# EasyEDA Pro project ProPrj_M-power_2025-07-25.epro, board 电源
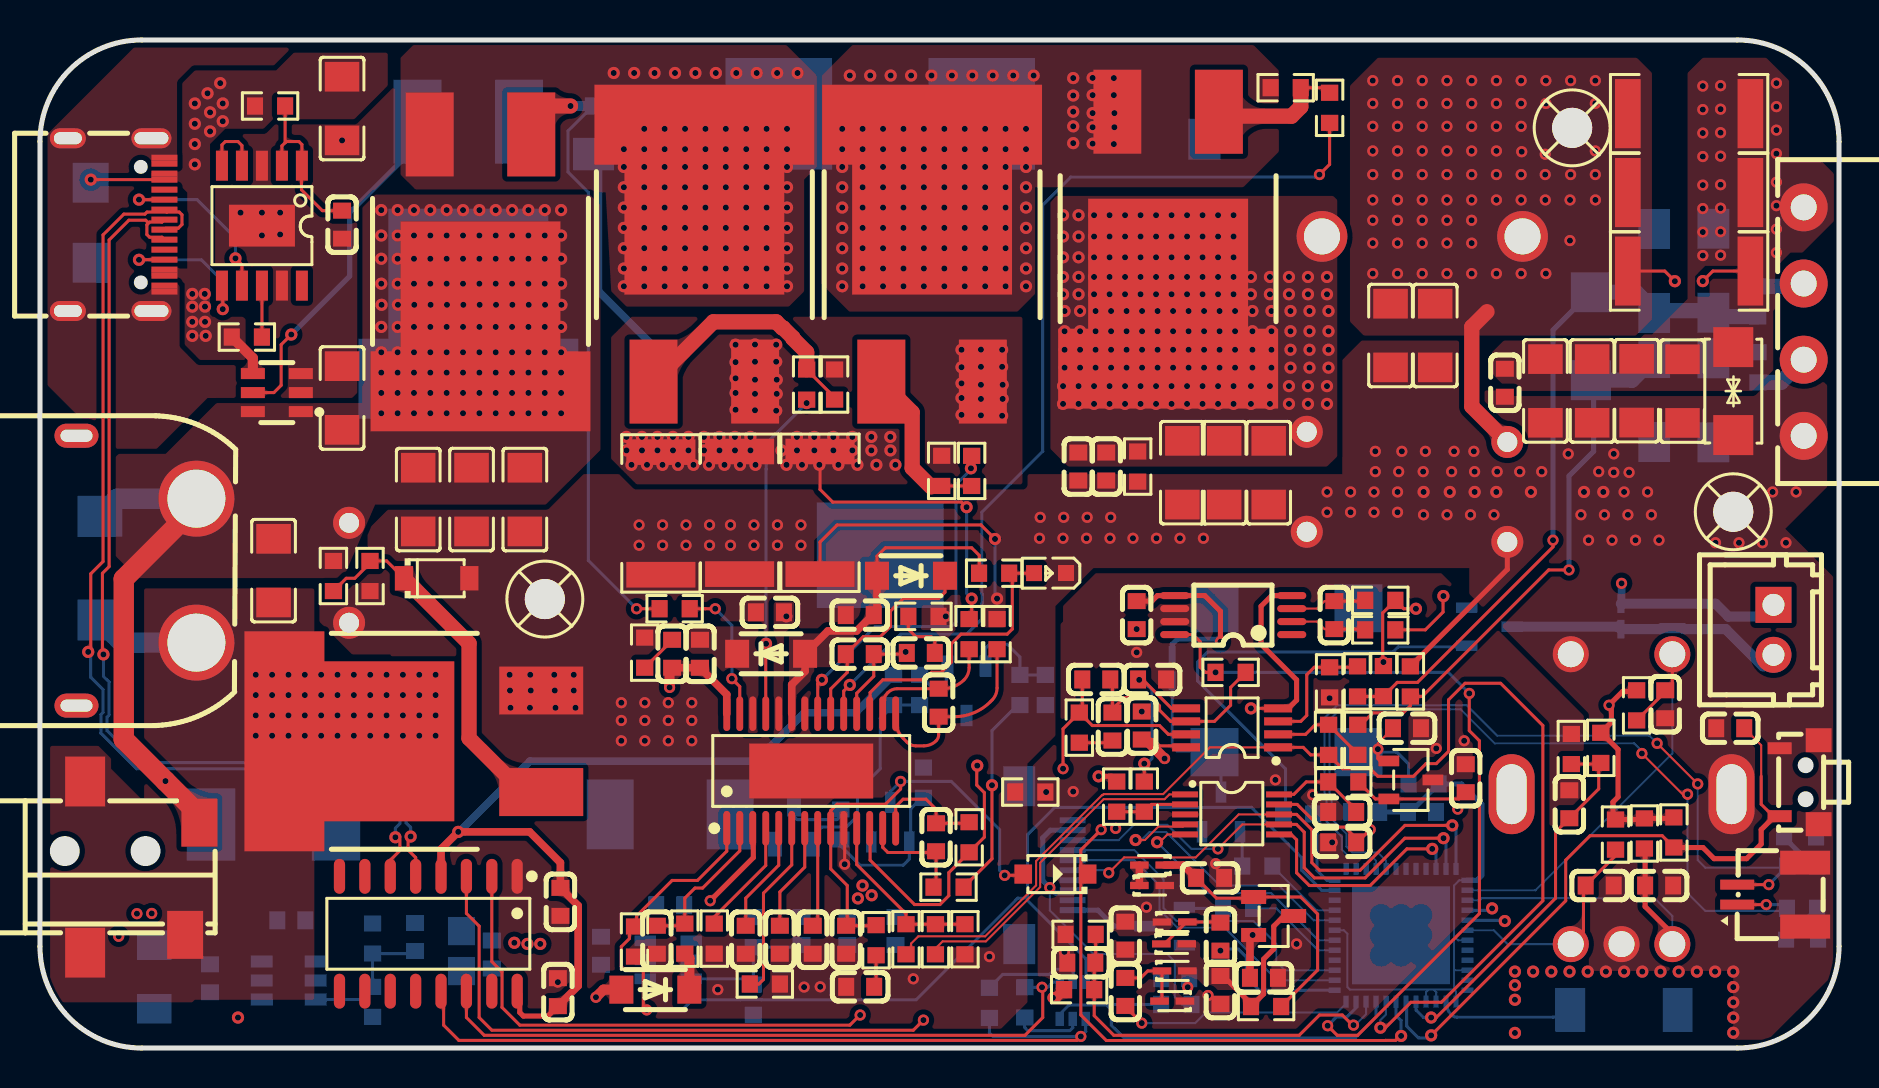
[diagram p2: board, top side]
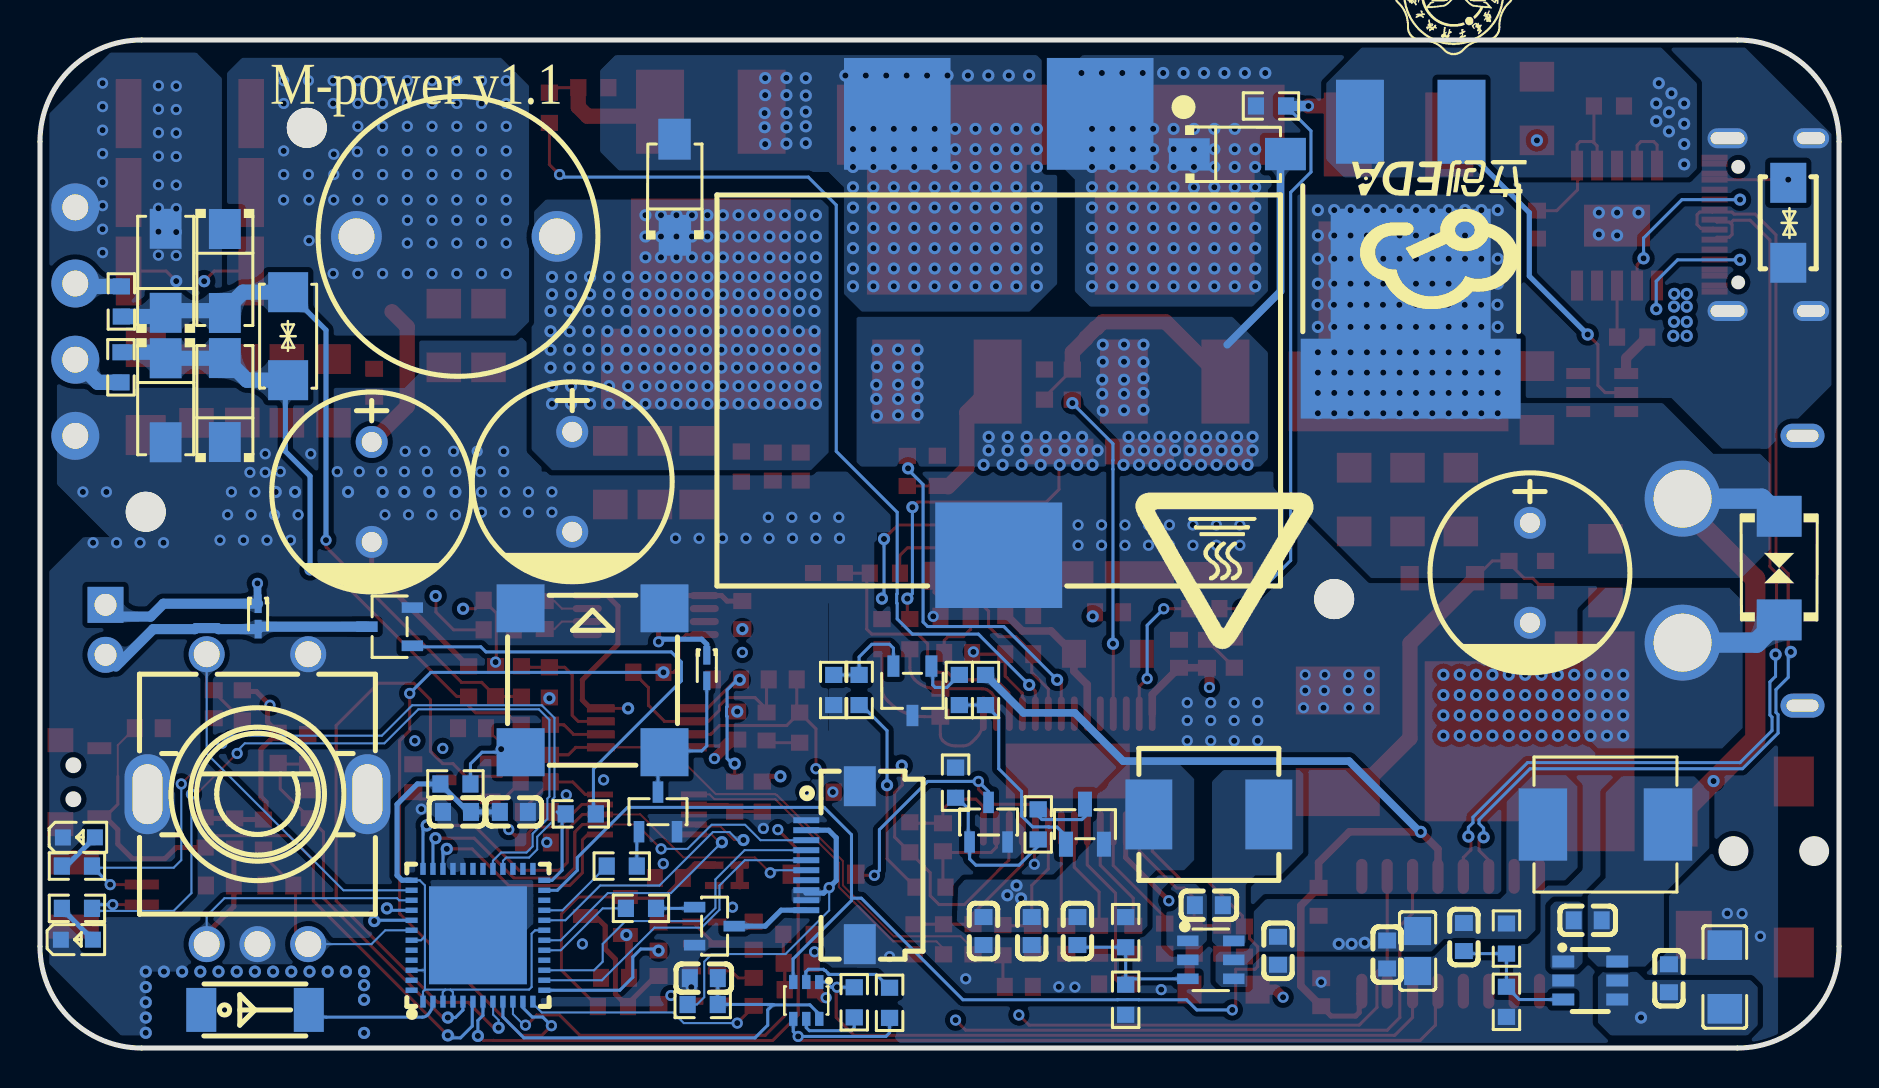
[diagram p3: board, bottom side, seen from below]

Outline 90 x 50.42 mm; copper layers: Top Layer, 内层1, 内层2, Bottom Layer. Coordinates in mm from the lower left corner of the outline.
Outline path: 0,45.34 0,5.08 arc(1.49,1.49) 5.08,0 84.92,0 arc(88.51,1.49) 90,5.08 90,45.34 arc(88.51,48.93) 84.92,50.42 5.08,50.42 arc(1.49,48.93) 0,45.34
Stack: Top Layer 0.035mm 外层铜厚1oz / Dielectric1 0.2104mm 7628 RC49% 8.6mil / 内层1 0.0152mm 内层铜厚 / Dielectric2 1.065mm 1.1mm H/HOZ Copper / 内层2 0.0152mm 内层铜厚 / Dielectric3 0.2104mm 7628 RC49% 8.6mil / Bottom Layer 0.035mm 外层铜厚1oz

## Design rules (mm)
net CS_P: LM5175
net CS_N: LM5175
net IS_P: Isense
net IS_N: Isense
net USB_P: usb
net USB_N: usb
template: 自定义配置
spacing copperThickness1oz (default): track to track 0.102, other pairs 0.152 to 0.3
spacing copperThickness2oz: track to track 0.203, other pairs 0.152 to 0.3
track width copperThickness1oz (default): min 0.102, default 0.254, max 2.54
track width copperThickness2oz: min 0.203, default 0.254, max 2.54
differential pair differentialPair (default): width min 0.102, default 0.254, max 2.54; gap min 0.152, default 0.152
via viaSize (default): diameter min 0.5, default 0.61, max 10; hole min 0.3, default 0.305, max 6.299

## Placement (name value [footprint] x y rotation side)
BUZZER1  2.7kHz  [BUZ-SMD_4P-L8.5-W8.5-P8.50-BR]  62.36 18.39 180 bottom
C1  1uF  [C1206]  21.59 27.43 90 top
C3  1uF  [C1206]  24.26 27.43 90 top
C6  22uF  [C1206]  15.11 46.99 90 top
C7  10uF  [C1206]  15.11 32.51 270 top
C8  1uF  [C0603]  15.11 41.18 90 top
C10  100nF  [C0603]  8.51 3.49 270 bottom
C11  10uF  [C1206]  5.72 3.55 270 bottom
C12  100nF  [C0603]  12.57 6.39 180 bottom
C13  150pF  [C0603]  18.77 5.55 90 bottom
C14  22uF  [C0805]  21.08 4.85 90 bottom
C15  100nF  [C0603]  22.61 4.68 90 bottom
C16  100nF  [C0603]  31.53 7.14 180 bottom
C17  22uF  [C0603]  40.39 5.85 90 bottom
C19  150pF  [C0603]  38.1 5.85 90 bottom
C20  22uF  [C0603]  28.07 4.86 90 bottom
C21  100nF  [C0603]  42.8 5.85 90 bottom
C22  22nF  [C0603]  35.31 5.42 90 top
C23  1.5nF  [C0603]  37.01 5.42 90 top
C24  100nF  [C0603]  38.66 5.42 90 top
C25  100nF  [C0603]  30.86 5.42 270 top
C26  10nF  [C0603]  44.83 10.54 90 top
C27  2.7nF  [C0603]  40.33 5.42 90 top
C28  22nF  [C0603]  41.03 3.06 0 top
C29  1nF  [C0603]  44.96 17.27 90 top
C30  100nF  [C0603]  33.02 19.72 90 top
C31  100nF  [C0603]  41.01 19.7 180 top
C32  1uF  [C0603]  41.01 21.65 180 top
C33  470pF  [C0603]  31.62 19.72 270 top
C34  470pF  [C0603]  44.06 19.76 180 top
C35  1uF  [C0603]  36.52 21.79 0 top
C36  1uF  [C1206]  18.92 27.43 90 top
C37  1uF  [C1206]  11.68 23.88 90 top
C38  470uF  [CAP-TH_BD10.0-P5.00-D0.6-FD-A]  63.37 28.32 270 bottom
C39  470uF  [CAP-TH_BD10.0-P5.00-D0.6-FD-A]  73.41 27.81 270 bottom
C40  100nF  [C0603]  53.34 29.08 90 top
C41  10uF  [C1206]  59.24 28.78 90 top
C42  10uF  [C1206]  61.47 28.78 90 top
C43  10uF  [C1206]  69.8 35.64 90 top
C44  1uF  [C1206]  67.56 35.64 90 top
C45  100nF  [C0603]  73.28 33.27 90 top
C47  10uF  [C1206]  82.17 32.86 90 top
C48  10uF  [C1206]  79.87 32.88 90 top
C49  100nF  [C0603]  51.94 29.08 90 top
C50  10uF  [C1206]  57.15 28.78 90 top
C52  10uF  [C1206]  75.31 32.86 90 top
C53  10uF  [C1206]  77.65 32.86 90 top
C54  10nF  [C0603]  64.75 21.65 270 top
C55  100nF  [C0603]  54.86 21.65 90 top
C56  10nF  [C0603]  55.63 18.43 180 top
C57  100nF  [C0603]  53.65 16.08 270 top
C58  1nF  [C0603]  52.84 18.43 180 top
C59  100nF  [C0603]  55.12 16.13 270 top
C60  10uF  [C0603]  61.23 3.51 0 top
C61  1uF  [C0603]  58.54 8.51 0 top
C62  100nF  [C0603]  66.29 11.81 0 bottom
C63  10uF  [C0603]  69.14 11.81 180 bottom
C64  100nF  [C0603]  56.79 3.5 180 bottom
C65  100nF  [C0603]  25.91 2.79 270 top
C66  100nF  [C0603]  26.04 7.31 90 top
C67  10nF  [C0603]  52.09 4.27 0 top
C68  1uF  [C0603]  68.39 16 180 top
C69  1uF  [C0603]  71.33 13.49 270 top
C70  100nF  [C0603]  59.05 5.57 90 top
C71  10uF  [C0603]  54.3 5.62 90 top
C72  100nF  [C0603]  54.3 2.81 90 top
C73  10uF  [C0603]  59.05 2.9 270 top
C74  10uF  [C0603]  65.14 11.81 0 top
C75  100nF  [C0603]  65.14 10.29 0 top
C76  100nF  [C0603]  81 8.13 0 top
C77  100nF  [C0603]  78.03 8.13 180 top
C78  100nF  [C0603]  81.3 17.19 90 top
C79  100nF  [C0603]  76.51 12.19 270 top
C80  100nF  [C0603]  84.56 16 0 top
C81  470uF  [CAP-TH_BD10.0-P5.00-D0.6-FD-A]  15.46 23.77 270 bottom
CN1  XT60PW-M  [CONN-TH_XT60PW-M]  4.83 23.88 0 top
CN2  KF2EDGR-3.81-4P  [CONN-TH_4P-P3.81_KF2EDGR-3.81-4P]  88.23 36.33 90 top
CN3  ZX-XH2.54-2PZZ  [CONN-TH_2P-P2.50_HX25003-2A]  86.72 20.92 270 top
D1  SMBJ30CA  [SMB_L4.6-W3.6-LS5.3-BI]  2.99 24 90 bottom
D2  BZT52C12  [SOD-123_L2.7-W1.6-LS3.7-RD]  19.84 23.5 0 top
D3  SMAJ22CA  [SMA_L4.4-W2.6-LS5.0-BI]  2.54 41.28 90 bottom
D5  SS56  [SMA_L4.3-W2.6-LS5.0-RD]  30.1 44.7 180 bottom
D7  SMAJ40CA  [SMA_L4.3-W2.6-LS5.0-BI]  84.71 32.86 90 top
D8  1N4148W  [SOD-123_L2.7-W1.6-LS3.7-FD]  50.8 8.7 0 top
D9  1N4007  [SMA_L4.3-W2.5-LS5.0-RD]  80.75 32.41 90 bottom
D10  1N4007  [SMA_L4.3-W2.5-LS5.0-RD]  83.71 32.4 270 bottom
D11  1N4007  [SMA_L4.3-W2.5-LS5.0-RD]  80.75 38.86 270 bottom
D12  1N4007  [SMA_L4.3-W2.5-LS5.0-RD]  83.71 38.87 90 bottom
D13  1N4148WT  [SOD-523_L1.2-W0.8-LS1.6-RD]  55.63 8.13 0 top
D14  1N4148WT  [SOD-523_L1.2-W0.8-LS1.6-RD]  55.63 9.15 180 top
D15  1N4148WT  [SOD-523_L1.2-W0.8-LS1.6-RD]  56.76 6.3 0 top
D16  1N4148WT  [SOD-523_L1.2-W0.8-LS1.6-RD]  56.73 5.21 0 top
D17  1N4148WT  [SOD-523_L1.2-W0.8-LS1.6-RD]  56.64 2.35 180 top
D18  1N4148WT  [SOD-523_L1.2-W0.8-LS1.6-RD]  56.76 3.86 0 top
D19  1N4148WT  [SOD-523_L1.2-W0.8-LS1.6-RD]  56.64 19.01 270 bottom
D20  1N4148WT  [SOD-523_L1.2-W0.8-LS1.6-RD]  79.09 21.59 270 bottom
D22  SMAJ40CA  [SMA_L4.3-W2.6-LS5.0-BI]  77.59 35.6 270 bottom
D23  DSK110  [SOD-123FL_L2.8-W1.9-LS3.7-RD]  36.58 19.72 0 top
D24  DSK110  [SOD-123FL_L2.8-W1.9-LS3.7-RD]  43.57 23.62 180 top
D25  DSK110  [SOD-123FL_L2.8-W1.9-LS3.7-RD]  30.79 2.92 180 top
D26  SS56  [SMA_L4.3-W2.6-LS5.0-RD]  58.25 43.05 90 bottom
FPC1  AFC01-S10FCA-00  [FPC-SMD_P0.5-10P_FGS-XJ-H2.0]  50.33 9.14 270 bottom
L1  10uH  [IND-SMD_L7.0-W6.6_FXL0630]  11.68 11.18 180 bottom
L2  10uH  [IND-SMD_L7.3-W6.8]  31.53 11.68 0 bottom
L3  10uH  [IND-SMD_3P-L28.0-W19.4_7443641000B]  42.04 35.69 0 bottom
L5  AN2051-245  [ANT2051]  79.24 1.91 180 bottom
L6  -  [2.2uh磁棒]  64.14 40.59 0 bottom
LED1  -  [LED_0603]  50.48 23.75 180 top
LED2  -  [LED_0603]  88 10.54 180 bottom
LED3  -  [LED_0603]  88.1 5.42 180 bottom
P1  DC031A 贴片  [DC-IN-SMD_DC031A]  5.12 9.05 0 top
Q3  S8550  [SOT-23-3_L2.9-W1.3-P1.90-LS2.4-BR]  37.72 11.2 270 bottom
Q4  S8050  [SOT-23-3_L2.9-W1.3-P1.90-LS2.3-BR]  42.55 11.3 270 bottom
Q5  SS8550  [SOT-23-3_L2.9-W1.3-P1.90-LS2.4-BR]  61.72 6.6 180 top
Q6  BC847BDW1T1G  [SOT-363_L2.0-W1.3-P0.65-LS2.1-TL]  51.67 2.38 270 bottom
Q7  S8050  [SOT-23-3_L2.9-W1.3-P1.90-LS2.3-BR]  59.08 11.81 270 bottom
Q8  SI2306  [SOT-23-3_L2.9-W1.4-P1.91-LS2.6-BR]  72.51 21.07 180 bottom
Q9  S8050  [SOT-23-3_L2.9-W1.3-P1.90-LS2.3-BR]  56.26 6.1 0 bottom
R1  100K  [R0603]  14.68 23.61 90 top
R2  150K  [R0603]  16.51 23.61 90 top
R3  10K  [R0603]  10.35 35.56 0 top
R4  1K  [R0603]  11.51 47.12 180 top
R5  10K  [R0603]  16.64 2.31 90 bottom
R6  140K  [R0603]  16.64 5.47 90 bottom
R7  100K  [R0603]  35.69 5.79 90 bottom
R8  22K  [R0603]  35.69 2.41 90 bottom
R9  10  [R0603]  32.26 5.47 90 top
R10  47k  [R0603]  36.26 3.2 180 top
R11  49.9K  [R0603]  33.73 5.47 90 top
R12  10K 0.1%  [R0603]  43.32 5.44 270 top
R13  10K 0.1%  [R0603]  44.8 5.44 90 top
R14  4.99K 0.1%  [R0603]  46.27 5.44 90 top
R15  3.3  [R0603]  45.45 8.05 180 top
R16  3.3  [R0603]  46.48 10.54 90 top
R17  6.8K  [R0603]  41.83 5.39 90 top
R18  10  [R0603]  46.48 20.7 90 top
R19  10  [R0603]  47.88 20.7 90 top
R20  20K  [R0603]  28.42 47.12 180 bottom
R21  20K  [R0603]  39.75 33.19 270 top
R22  20K  [R0603]  62.32 48.03 0 top
R23  20K  [R0603]  45.11 28.87 270 top
R24  5mΩ  [R2512]  35 26.77 90 top
R25  5mΩ  [R2512]  31.06 26.74 90 top
R26  5mΩ  [R2512]  39.02 26.77 90 top
R27  1  [R0603]  31.75 21.97 180 top
R28  1  [R0603]  38.35 33.18 90 top
R29  1  [R0603]  64.52 47.03 270 top
R30  1  [R0603]  46.61 28.86 90 top
R31  10K  [R0603]  29.74 5.33 270 top
R32  10K  [R0603]  47.73 23.75 180 top
R33  10  [R0603]  30.25 19.78 270 top
R34  10  [R0603]  44.2 21.59 180 top
R35  NC  [R0603]  54.91 29.08 90 top
R36  5mΩ  [R2512]  82.5 38.86 0 top
R37  5mΩ  [R2512]  82.5 42.79 0 top
R38  5mΩ  [R2512]  82.5 46.74 0 top
R39  1  [R0603]  67.05 20.92 180 top
R40  1  [R0603]  67.05 22.39 180 top
R41  10K  [R0603]  59.56 18.79 0 top
R42  10K  [R0603]  55.24 12.57 90 top
R43  20K  [R0603]  53.86 12.57 270 top
R44  2.2K  [R0603]  51.99 16.02 90 top
R45  1M 0.1%  [R0603]  65.92 15.42 270 top
R46  1M 0.1%  [R0603]  65.91 18.34 90 top
R47  68K 0.1%  [R0603]  64.46 15.42 270 top
R48  68K 0.1%  [R0603]  64.52 18.29 270 top
R49  10K  [R0603]  68.56 18.34 270 top
R50  10K  [R0603]  67.21 18.35 90 top
R51  2.2  [R0603]  85.95 34.05 90 bottom
R52  2.2  [R0603]  85.93 37.34 270 bottom
R53  1M  [R0603]  49.02 17.91 270 bottom
R54  51K  [R0603]  50.29 17.91 90 bottom
R55  200  [R0603]  44.01 17.91 270 bottom
R56  1K  [R0603]  42.7 17.91 270 bottom
R57  4.7K  [R0603]  40.06 11.18 90 bottom
R58  10K  [R0603]  44.2 13.27 270 bottom
R59  10K  [R0603]  61.34 2.07 0 top
R60  0  [R0603]  69.22 13.21 180 bottom
R61  10K  [R0603]  56.85 2.18 0 bottom
R62  1K  [R0603]  47.5 2.26 270 bottom
R63  1K  [R0603]  49.27 2.29 270 bottom
R64  1M 0.1%  [R0603]  51.99 2.92 180 top
R65  68K 0.1%  [R0603]  52.06 5.68 180 top
R66  0  [R0603]  65.2 13.31 0 top
R67  10K  [R0603]  79.87 17.14 90 top
R68  10K  [R0603]  80.26 10.73 270 top
R69  10K  [R0603]  78.82 10.67 90 top
R70  470  [R0603]  60.9 9.1 180 bottom
R71  1K  [R0603]  62.95 11.71 180 bottom
R72  NCP18XH103F03RB  [R0603]  76.61 14.95 270 top
R73  1K  [R0603]  78.08 15.01 90 top
R74  470  [R0603]  59.93 6.98 180 bottom
R75  10K  [R0603]  81.74 10.78 90 top
R76  510  [R0603]  88.15 9.1 180 bottom
R77  510  [R0603]  88.15 6.98 180 bottom
R78  0  [R0603]  49.54 12.8 180 top
SCREW2  -  [M2螺丝]  25.26 22.45 0 top
SCREW3  -  [M2螺丝]  84.71 26.82 0 top
SCREW4  -  [M2螺丝]  76.65 46.02 0 top
SW1  EC11E18244AU  [SW-TH_EC11XXXXXXXX]  79.12 12.45 180 bottom
SW2  TS-1010-C-A  [KEY-SMD_TX-1010-X-X]  88.01 13.3 270 top
U1  CSD18536KTT  [TO-263-3_L10.4-W10.1-P5.08-LS15.4-BRM]  44.63 38.13 0 top
U2  LM5050MKX-1/NOPB  [TSOT-23-6_L2.9-W1.6-P0.95-LS2.8-BL]  11.85 32.78 90 top
U3  CH224K  [ESSOP-10_L4.9-W3.9-P1.0-LS6.0-TL-EP]  11.1 41.13 180 top
U4  ME3121AM6G  [SOT-23-6_L2.9-W1.6-P0.95-LS2.8-BR]  12.45 3.38 0 bottom
U5  SY8120IABC  [SOT-23-6_L2.9-W1.6-P0.95-LS2.8-BL]  31.43 4.41 270 bottom
U6  LM5175PWPR  [HTSSOP-28_L9.8-W4.5-P0.65-LS6.6-BL-EP]  38.58 13.86 0 top
U7  CSD18536KTT  [TO-263-3_L10.4-W10.1-P5.08-LS15.4-BRM]  22.04 40.89 180 top
U8  CSD18536KTT  [TO-263-3_L10.4-W10.1-P5.08-LS15.4-BRM]  33.24 38.13 0 top
U9  CSD18536KTT  [TO-263-3_L10.4-W10.1-P5.08-LS15.4-BRM]  56.44 42.03 180 top
U10  INA240A2PWR  [TSSOP-8_L4.4-W3.0-P0.65-LS6.4-BL]  59.69 21.65 90 top
U11  RS8552XM  [MSOP-8_L3.0-W3.0-P0.65-LS4.9-BL]  59.64 16.01 90 top
U12  TL431AIDBZR  [SOT-23-3_L2.9-W1.6-P1.90-LS2.8-BR]  46.36 17.87 90 bottom
U13  ESP32-PICO-D4  [LGA-48_L7.0-W7.0-P0.50-BL-EP5.4]  68.09 5.64 180 bottom
U14  CH340C  [SOP-16_L10.0-W3.9-P1.27-LS6.0-BL]  19.43 5.72 180 top
U15  REF3033AIDBZR  [SOT-23-3_L3.0-W1.7-P0.95-LS2.9-BR]  68.58 13.41 180 top
U16  DAC8562SDGSR  [VSSOP-10_L3.0-W3.0-P0.50-LS4.9-BL]  59.64 11.68 270 top
U18  CSD18536KTT  [TO-263-3_L10.4-W10.1-P5.08-LS15.4-BRM]  21.43 41.53 0 bottom
U19  CSD18536KTT  [TO-263-3_L10.4-W10.1-P5.08-LS15.4-BRM]  20.28 15.34 90 top
U20  WAFER-SH1.0-2PWB  [CONN-SMD_2P-P1.00_XUNPU_WAFER-SH1.0-2PWB]  86.61 7.67 90 top
USB1  KH-TYPE-C-16P  [USB-C-SMD_KH-TYPE-C-16P]  3.81 41.18 270 top

## Footprints (pads in the part's own frame, mm; a bottom-side part is the same pattern mirrored in y, then rotated)
2.2uh磁棒
  round 2.54 hole 1.8: 1(0,0) 2(10.033,0)
ANT2051
  rect 1.5x2.2 smd: 1(-2.69,0) 2(2.69,0)
BUZ-SMD_4P-L8.5-W8.5-P8.50-BR
  rect 2.4x2.4 smd: 1(-3.6,-3.6) 2(3.6,-3.6) 3(3.599,3.599) 4(-3.6,3.6)
C0603
  rect 0.8x0.9 smd: 1(-0.7,0) 2(0.7,0)
C0805
  rect 1.41x1.35 smd: 1(-1,0) 2(1,0)
C1206
  rect 1.485x1.728 smd: 1(-1.593,0) 2(1.593,0)
CAP-TH_BD10.0-P5.00-D0.6-FD-A
  round 1.6 hole 1: 1(-2.5,0) 2(2.5,0)
CONN-SMD_2P-P1.00_XUNPU_WAFER-SH1.0-2PWB
  rect 0.5x1.7 smd: 1(-0.5,1.7) 2(0.5,1.7)
  rect 1.2x2.5 smd: 3(1.6,-1.7) 4(-1.6,-1.7)
CONN-TH_2P-P2.50_HX25003-2A
  rect 1.8x1.8 hole 1.1: 1(-1.25,0)
  round 1.8 hole 1.1: 2(1.25,0)
CONN-TH_4P-P3.81_KF2EDGR-3.81-4P
  round 2.4 hole 1.3: 1(-5.715,0) 2(-1.905,0) 3(1.905,0) 4(5.715,0)
CONN-TH_XT60PW-M
  round 3.8 hole 2.9: 1(3,-3.6) 2(3,3.6)
  oval 2.2x1.2 hole 1.6x0.6: 3(-3,6.75) 4(-3,-6.75)
DC-IN-SMD_DC031A
  rect 1.8x2.401 smd: 2(2.857,2.223) 3(2.146,-3.391)
  rect 2x2.5 smd: 4(-2.857,4.28) 4(-2.857,-4.28)
ESSOP-10_L4.9-W3.9-P1.0-LS6.0-TL-EP
  rect 0.6x1.5 smd: 1(-2,-3) 2(-1,-3) 3(0,-3) 4(1,-3) 5(2,-3) 6(2,3) 7(1,3) 8(0,3) 9(-1,3) 10(-2,3)
  rect 3.3x2.1 smd: 11(0,0)
FPC-SMD_P0.5-10P_FGS-XJ-H2.0
  rect 0.3x1.3 smd: 1(-2.25,-1.339) 2(-1.75,-1.339) 3(-1.25,-1.34) 4(-0.75,-1.339) 5(-0.25,-1.34) 6(0.25,-1.339) 7(0.75,-1.339) 8(1.25,-1.339) 9(1.75,-1.339) 10(2.25,-1.34)
  rect 2x1.6 smd: 11(3.95,1.34) 12(-3.95,1.34)
HTSSOP-28_L9.8-W4.5-P0.65-LS6.6-BL-EP
  oval 0.343x1.732 smd: 1(-4.225,-2.866) 2(-3.575,-2.866) 3(-2.925,-2.866) 4(-2.275,-2.866) 5(-1.625,-2.866) 6(-0.975,-2.866) 7(-0.325,-2.866) 8(0.325,-2.866) 9(0.975,-2.866) 10(1.625,-2.866) 11(2.275,-2.866) 12(2.925,-2.866) 13(3.575,-2.866) 14(4.225,-2.866) 15(4.225,2.866) 16(3.575,2.866) 17(2.925,2.866) 18(2.275,2.866) 19(1.625,2.866) 20(0.975,2.866) 21(0.325,2.866) 22(-0.325,2.866) 23(-0.975,2.866) 24(-1.625,2.866) 25(-2.275,2.866) 26(-2.925,2.866) 27(-3.575,2.866) 28(-4.225,2.866)
  rect 6.2x2.75 smd: 29(0,0)
IND-SMD_3P-L28.0-W19.4_7443641000B
  rect 5.33x5.59 smd: 1(-5.075,-11.037) 2(5.075,-11.037)
  rect 6.35x5.28 smd: 3(0,11.037)
IND-SMD_L7.0-W6.6_FXL0630
  rect 2.424x3.62 smd: 1(3.128,0) 2(-3.128,0)
IND-SMD_L7.3-W6.8
  rect 2.35x3.5 smd: 1(-3,0) 2(3,0)
KEY-SMD_TX-1010-X-X
  rect 0.6x1.2 smd: 1(-1.7,-0.975) 2(1.7,-0.975)
  rect 1.2x1.3 smd: 3(-2.1,0.975) 4(2.1,0.975)
LED_0603
  rect 0.8x0.8 smd: 1(-0.851,-0.01) 2(0.75,-0.005)
LGA-48_L7.0-W7.0-P0.50-BL-EP5.4
  rect 0.27x0.6 smd: 1(-2.75,-3.32) 2(-2.25,-3.32) 3(-1.75,-3.32) 4(-1.25,-3.32) 5(-0.75,-3.32) 6(-0.25,-3.32) 7(0.25,-3.32) 8(0.75,-3.32) 9(1.25,-3.32) 10(1.75,-3.32) 11(2.25,-3.32) 12(2.75,-3.32) 25(2.75,3.32) 26(2.25,3.32) 27(1.75,3.32) 28(1.25,3.32) 29(0.75,3.32) 30(0.25,3.32) 31(-0.25,3.32) 32(-0.75,3.32) 33(-1.25,3.32) 34(-1.75,3.32) 35(-2.25,3.32) 36(-2.75,3.32)
  rect 0.6x0.27 smd: 13(3.32,-2.75) 14(3.32,-2.25) 15(3.32,-1.75) 16(3.32,-1.25) 17(3.32,-0.75) 18(3.32,-0.25) 19(3.32,0.25) 20(3.32,0.75) 21(3.32,1.25) 22(3.32,1.75) 23(3.32,2.25) 24(3.32,2.75) 37(-3.32,2.75) 38(-3.32,2.25) 39(-3.32,1.75) 40(-3.32,1.25) 41(-3.32,0.75) 42(-3.32,0.25) 43(-3.32,-0.25) 44(-3.32,-0.75) 45(-3.32,-1.25) 46(-3.32,-1.75) 47(-3.32,-2.25) 48(-3.32,-2.75)
  rect 4.9x4.9 smd: 49(0,0)
M2螺丝
  round 2 hole 2: 1(0,0)
MSOP-8_L3.0-W3.0-P0.65-LS4.9-BL
  rect 0.406x1.397 smd: 1(-0.975,-2.3) 2(-0.325,-2.3) 3(0.325,-2.3) 4(0.975,-2.3) 5(0.975,2.3) 6(0.325,2.3) 7(-0.325,2.3) 8(-0.975,2.3)
R0603
  rect 0.806x0.864 smd: 1(-0.753,0) 2(0.753,0)
R2512
  rect 1.282x3.456 smd: 1(-3.067,0) 2(3.067,0)
SMA_L4.3-W2.5-LS5.0-RD
  rect 2x1.593 smd: 1(-2.1,0) 2(2.1,0)
SMA_L4.3-W2.6-LS5.0-BI
  rect 2x2 smd: 1(-2.2,0) 2(2.2,0)
SMA_L4.3-W2.6-LS5.0-RD
  rect 2.046x1.62 smd: 1(-2.404,-0.009) 2(2.404,0.009)
SMA_L4.4-W2.6-LS5.0-BI
  rect 2x1.8 smd: 1(-2,0) 2(2,0)
SMB_L4.6-W3.6-LS5.3-BI
  rect 2.047x2.241 smd: 1(-2.591,0) 2(2.591,0)
SOD-123_L2.7-W1.6-LS3.7-FD
  rect 0.88x0.96 smd: 1(-1.61,0) 2(1.61,0)
SOD-123_L2.7-W1.6-LS3.7-RD
  rect 0.91x1.22 smd: 1(-1.635,0) 2(1.635,0)
SOD-123FL_L2.8-W1.9-LS3.7-RD
  rect 1.2x1.4 smd: 1(-1.7,0) 2(1.7,0)
SOD-523_L1.2-W0.8-LS1.6-RD
  rect 0.93x0.36 smd: 1(-0.635,0) 2(0.635,0)
SOP-16_L10.0-W3.9-P1.27-LS6.0-BL
  oval 0.56x1.745 smd: 1(-4.445,-2.873) 2(-3.175,-2.873) 3(-1.905,-2.873) 4(-0.635,-2.873) 5(0.635,-2.873) 6(1.905,-2.873) 7(3.175,-2.873) 8(4.445,-2.873) 9(4.445,2.873) 10(3.175,2.873) 11(1.905,2.873) 12(0.635,2.873) 13(-0.635,2.873) 14(-1.905,2.873) 15(-3.175,2.873) 16(-4.445,2.873)
SOT-23-3_L2.9-W1.3-P1.90-LS2.3-BR
  rect 1.07x0.532 smd: 1(0.99,-0.95) 2(0.99,0.95) 3(-0.99,0)
SOT-23-3_L2.9-W1.3-P1.90-LS2.4-BR
  rect 1.25x0.7 smd: 1(1,-0.95) 2(1,0.95) 3(-1,0)
SOT-23-3_L2.9-W1.4-P1.91-LS2.6-BR
  rect 1.07x0.532 smd: 1(1.135,-0.955) 2(1.135,0.955) 3(-1.135,0)
SOT-23-3_L2.9-W1.6-P1.90-LS2.8-BR
  rect 1.07x0.6 smd: 1(1.235,-0.95) 2(1.235,0.95) 3(-1.235,0)
SOT-23-3_L3.0-W1.7-P0.95-LS2.9-BR
  rect 1.038x0.532 smd: 1(1.101,-0.95) 2(1.101,0.95) 3(-1.101,0)
SOT-23-6_L2.9-W1.6-P0.95-LS2.8-BL
  rect 0.532x1.072 smd: 1(-0.95,-1.149) 2(0,-1.149) 3(0.95,-1.149) 4(0.95,1.149) 5(0,1.149) 6(-0.95,1.149)
SOT-23-6_L2.9-W1.6-P0.95-LS2.8-BR
  rect 1.1x0.6 smd: 1(1.35,-0.95) 2(1.35,0) 3(1.35,0.95) 4(-1.35,0.95) 5(-1.35,0) 6(-1.35,-0.95)
SOT-363_L2.0-W1.3-P0.65-LS2.1-TL
  rect 0.7x0.42 smd: 1(-0.92,0.65) 2(-0.92,0) 3(-0.92,-0.65) 4(0.92,-0.65) 5(0.92,0) 6(0.92,0.65)
SW-TH_EC11XXXXXXXX
  oval 2.3x4 hole 1.5x3: 6(5.5,0.25) 7(-5.5,0.25)
  round 1.8 hole 1.3: A(-2.54,-7.25) B(2.54,-7.25) C(0,-7.25) D(-2.54,7.25) E(2.54,7.25)
TO-263-3_L10.4-W10.1-P5.08-LS15.4-BRM
  rect 2.4x4.2 smd: 1(-2.54,-4.8) 3(2.54,-4.8)
  custom 11x10.5 smd: 2(0,4.8)
TSOT-23-6_L2.9-W1.6-P0.95-LS2.8-BL
  rect 0.55x1.2 smd: 1(-0.95,-1.2) 2(0,-1.2) 3(0.95,-1.2) 4(0.95,1.2) 5(0,1.2) 6(-0.95,1.2)
TSSOP-8_L4.4-W3.0-P0.65-LS6.4-BL
  oval 0.353x1.454 smd: 1(-0.975,-2.927) 2(-0.325,-2.927) 3(0.325,-2.927) 4(0.975,-2.927) 5(0.975,2.927) 6(0.325,2.927) 7(-0.325,2.927) 8(-0.975,2.927)
USB-C-SMD_KH-TYPE-C-16P
  oval 1x2 hole 0.6x1.7: 1(-4.32,1.765) 2(4.32,1.765)
  oval 1x1.8 hole 0.6x1.4: 3(-4.32,-2.415) 4(4.32,-2.415)
  rect 0.3x1.3 smd: A1(-3.35,2.415) A4(-2.55,2.415) A5(-1.25,2.415) A6(-0.25,2.415) A7(0.25,2.415) A8(1.25,2.415) A9(2.55,2.415) A12(3.35,2.415) B1(3.05,2.415) B4(2.25,2.415) B5(1.75,2.415) B6(0.75,2.415) B7(-0.75,2.415) B8(-1.75,2.415) B9(-2.25,2.415) B12(-3.05,2.415)
VSSOP-10_L3.0-W3.0-P0.50-LS4.9-BL
  rect 0.3x1.3 smd: 1(-1,-2.35) 2(-0.5,-2.35) 3(0,-2.35) 4(0.5,-2.35) 5(1,-2.35) 6(1,2.35) 7(0.5,2.35) 8(0,2.35) 9(-0.5,2.35) 10(-1,2.35)

## Nets
As in the schematic.

Pads without a net: CN1 3 4; FPC1 7; L5 1; U3 10; U10 1; U13 25 26 27 30 31 32 33 44 45 47 48; U14 7 8 9 10 11 12 15; USB1 A8 B8

## Via types
v1: diameter 0.559, hole 0.305, Top Layer to Bottom Layer, 264 vias
v2: diameter 0.61, hole 0.305, Top Layer to Bottom Layer, 729 vias

## Routing (per net, layer and track width the routed paths; a pad name or vN(x,y) marks a point on that pad's centre or on a via; arc(x,y) is an arc through that point)
3.3V: length 171.9
  Top Layer w0.102: 67.69,16 66.93,15.24 v1(66.93,14.95)
  Top Layer w0.152: U11.8 57.26,15.11 56.01,15.11 55.69,15.43 55.31,15.43 ; U16.9 62.89,12.18 64.03,11.05 65.28,11.05 65.84,10.48 65.84,10.29 65.91,10.29 v1(66.55,10.93) 66.55,10.86 ; U15.1 67.05,14.36 66.93,14.48 v1(66.93,14.95)
  Top Layer w0.254: U14.16 24,2.71 24,1.78 24.18,1.6 25.41,1.6 C65.2 ; C55.2 55.63,22.35 55.9,22.63 U10.5 58.27,22.63 59.05,21.84 v1(59.05,20.32) ; R67.2 79.82,17.83 79.17,17.83 78.61,17.27 78.61,16.3 R73.2 78.11,15.77 78.95,14.93 78.95,12.56 78.69,12.3 78.69,11.56 R69.2 80.21,11.43 R68.1 81.69,11.48 R75.2
  Top Layer w0.381: U14.4 20.06,9.95 v2(20.92,10.81) 24.5,10.81 26.04,9.27 C66.2 26.92,7.12 26.92,3.11 C65.2
  Top Layer w0.508: C59.2 55.31,15.43 v1(56.26,14.48)
  内层1 w0.508: 67.31,15.71 62.7,20.32 v1(59.05,20.32) ; 67.31,15.71 67.99,16.38 72.01,16.38 72.77,17.14 78.74,17.14 79.5,17.91 ; 67.31,15.71 67.31,15.11 ; v2(41.61,7.64) 41.92,7.95 53.48,7.95 57.87,3.56 64.52,3.56 65.91,4.95 65.91,10.29 67.31,11.68 67.31,15.11 ; 67.31,15.11 66.29,14.1 56.64,14.1 v1(56.26,14.48)
  内层1 w0.762: v2(40.92,7.48) 41.15,7.71 v2(41.15,8.13) 41.61,7.67 v2(41.61,7.64)
  Bottom Layer w0.102: R61.2 57.13,2.18 56.77,2.54 56.77,4.32 56.39,4.7 52.7,4.7 50.52,6.89 v1(50.52,8.02)
  Bottom Layer w0.152: BUZZER1.1 67.88,14.79 68.46,14.21 R60.2
  Bottom Layer w0.254: v1(59.05,20.32) 58.93,20.45 56.9,20.45 56.64,20.19 D19.1 ; 51.69,7.75 50.8,7.75 50.52,8.02 v1(50.52,8.02) 50.17,8.38 50.17,10.51 50.55,10.89 FPC1.2
  Bottom Layer w0.381: R56.1 40.8,16.76 38.23,16.76 35.81,14.35 24.51,14.35 20.97,10.81 v2(20.92,10.81)
  vias: v1(78.49,17.14)
9V: length 77.4
  内层1 w0.381: 70.48,24.13 72.64,24.13 73.53,23.24 v1(79.12,23.24)
  内层1 w0.762: 70.48,24.13 53.34,24.13 47.69,18.48 42.99,18.48 39.37,22.1 37.85,22.1 v2(37.34,21.59) 37.16,21.41 37.16,19.87 34.42,17.13 34.42,14.6 v2(25.03,5.21) 24.97,5.26 v2(23.73,5.26)
  Bottom Layer w0.381: D20.1 79.12,22.25 v1(79.12,23.24)
  Bottom Layer w0.508: D20.1 83.82,22.22 84.47,21.58 86.21,21.58
  vias: v2(24.38,5.21)
-0.6V: length 39.4
  Top Layer w0.152: U11.4 v2(60.58,16.99)
  Top Layer w0.254: R43.1 53.6,13.59 v2(52.96,13.59) ; U10.4 61.62,22.63 61.09,22.1 61.09,20.19 62.86,18.42 62.86,17.4 62.48,17.02 61.97,17.02 U11.4
  Top Layer w0.381: C60.1 60.53,5.52 v2(60.67,5.65)
  内层1 w0.254: v2(54.86,20.95) 55.75,20.06 55.75,17.65 55.24,17.14 55.24,16.96 55.28,16.99 v2(60.58,16.99) ; 52.96,13.46 53.09,13.34 54.48,13.34 57.15,10.67 57.15,9.02 60.51,5.65 v2(60.67,5.65) ; 52.96,13.46 v2(52.96,13.59) ; 52.96,13.46 52.83,13.59 52.83,14.99 54.67,16.83 v2(55.12,16.83)
-2V: length 7.9
  Top Layer w0.254: 59.06,3.6 59.2,3.6 60.58,2.21 R59.1 61.21,2.7 61.21,4.45 61.72,4.95 61.72,6.1 62.23,6.6 Q5.3
AGND:
  vias: v1(50.34,12.8) v1(51.25,4.81) v1(51.69,12.83) v1(54.86,19.79) v1(55.35,7.04) v1(58.43,2.63) v1(58.82,9.22) v1(61.8,13.41) v1(62.86,5.21) v1(63.67,12.66) v1(64.64,10.29) v1(69.85,14.99) v1(71.25,15.37) v2(64.52,17.49)
GND: length 24.1
  Top Layer w0.152: R26.1 39.02,25.31 39.88,26.16 47.07,26.16 v2(47.78,25.46) ; v1(40.26,9.19) 40.26,10.94 U6.10
  Top Layer w0.254: R49.1 73.41,23.94 C39.2
  Bottom Layer w0.152: v2(47.78,25.46) 47.78,22.58 v2(47.88,22.48)
  vias: v1(3.94,5.59) v1(4.85,6.72) v1(5.59,6.73) v1(23.49,18.67) v1(23.51,17.88) v1(23.54,17.02) v1(24.53,18.67) v1(24.51,17.02) v1(24.55,17.88) v1(25.73,18.67) v1(25.75,17.88) v1(25.79,17.02) v1(25.91,3.29) v1(26.7,18.67) v1(26.7,17.88) v1(26.79,17.02) v1(29.08,17.27) v1(29.08,16.38) v1(29.08,15.37) v1(29.97,26.16) v1(29.97,25.15) v1(30.26,17.27) v1(30.26,16.38) v1(30.26,15.37) v1(31.15,26.16) v1(31.15,25.15) v1(31.43,17.27) v1(31.43,16.38) v1(31.43,15.37) v1(32.32,26.16) v1(32.32,25.15) v1(32.61,17.27) v1(32.61,16.38) v1(32.61,15.37) v1(33.5,26.16) v1(33.5,25.15) v1(33.91,2.92) v1(34.54,26.16) v1(34.54,25.15) v1(35.72,26.16) v1(35.72,25.15) v1(36.89,26.16) v1(36.89,25.15) v1(38.07,26.16) v1(38.07,25.15) v1(38.23,3.05) v1(39.03,3.06) v1(43.69,3.46) v1(45.31,21.59) v1(47.5,4.57) v1(50,25.5) v1(50.04,26.54) v1(51.21,26.54) v1(51.18,25.5) v1(52.39,26.54) v1(52.35,25.5) v1(53.53,25.5) v1(53.56,26.54) v1(53.81,10.98) v1(54.68,25.5) v1(55.85,25.5) v1(57.03,25.5) v1(57.42,3.04) v1(58.2,25.5) v1(64.39,27.81) v1(64.39,26.8) v1(65.56,27.81) v1(65.56,26.8) v1(66.8,29.84) v1(66.8,28.83) v1(66.74,27.81) v1(66.74,26.8) v1(67.91,27.81) v1(67.91,26.8) v1(67.97,28.83) v1(68.13,29.84) v1(69.2,28.83) v1(69.21,26.67) v1(69.31,29.84) v1(70.39,26.67) v1(70.62,28.83) v1(70.74,29.84) v1(70.92,11.95) v1(71.56,26.67) v1(71.73,29.84) v1(71.77,28.83) v1(72.74,26.67) v1(72.9,28.83) v1(74.03,28.83) v1(75.13,28.83) v1(76.45,29.72) v1(77.09,26.67) v1(77.47,25.4) v1(77.98,28.83) v1(78.26,26.67) v1(78.64,25.4) v1(78.73,29.72) v1(78.73,28.79) v1(79.25,27.81) v1(79.5,28.79) v1(79.44,26.67) v1(79.82,25.4) v1(80.42,27.81) v1(80.61,26.67) v1(80.99,25.4) v1(83.82,25.27) v1(84.99,25.27) v1(86.17,25.27) v1(86.68,27.81) v1(87.34,25.27) v1(87.85,27.81) v2(10.03,41.78) v2(11.1,41.78) v2(11.1,40.64) v2(12.02,41.78) v2(12.02,40.69) v2(15.11,45.4) v2(69.22,27.81) v2(70.53,27.81) v2(71.77,27.81) v2(72.86,27.81) v2(73.79,3.82) v2(73.79,3.14) v2(73.79,2.41) v2(73.79,0.76) v2(74.59,27.81) v2(74.7,3.82) v2(75.61,3.82) v2(76.52,3.82) v2(77.24,27.81) v2(77.43,3.82) v2(78.21,27.81) v2(78.34,3.82) v2(79.25,3.82) v2(80.16,3.82) v2(81.07,3.82) v2(81.98,3.82) v2(82.89,3.82) v2(83.8,3.82) v2(84.71,3.82) v2(84.71,3.05) v2(84.71,2.29) v2(84.71,1.52) v2(84.71,0.76)
VBUS: length 5.9
  Top Layer w0.152: USB1.B9 v2(2.54,43.43)
  Top Layer w0.508: U2.4 10.65,34.51 9.6,35.56
  vias: v2(7.62,37.72) v2(7.62,37.08) v2(7.62,36.32) v2(7.62,35.62) v2(7.75,47.24) v2(7.75,46.23) v2(7.75,45.21) v2(7.75,44.2) v2(8.24,37.72) v2(8.25,37.08) v2(8.26,36.32) v2(8.29,35.62) v2(8.38,47.75) v2(8.51,46.8) v2(8.51,45.85) v2(9.02,48.26) v2(9.14,47.24) v2(9.14,46.36)
VCC: length 16.9
  Top Layer w0.152: D24.2 41.87,24.6 42.29,25.02 46.61,25.02 46.99,24.64 46.99,23.76 R32.2
  Top Layer w0.381: D24.2 41.87,21.81 C32.1 41.65,21.65 40.85,20.86 39.42,20.86 D23.2 38.28,18.84 37.61,18.18 U6.23
VIN: length 89.7
  Top Layer w0.254: U6.3 35.69,10.96 35.69,9.53 v1(33.53,7.37)
  Top Layer w0.508: v1(50.67,2.52) 50.83,2.52 R64.2 ; v1(27.81,2.54) 28.19,2.92 D25.2
  Top Layer w1.016: CN1.2 7.83,27.09 4.19,23.46 4.19,15.44 v2(6.28,13.35) 7.97,11.65 P1.2
  内层1 w0.152: v1(33.53,7.37) 38.1,7.37 42.93,2.54 49.91,2.54 49.92,2.53 50.34,2.53 50.35,2.54 50.65,2.54 v1(50.67,2.52)
  内层1 w0.508: v1(33.53,7.37) 32.64,7.37 v1(27.81,2.54)
  内层1 w0.762: v2(6.28,13.35) 8.89,10.74 8.89,2.54 v2(9.91,1.52) 26.8,1.52 v1(27.81,2.54)
  Bottom Layer w1.016: CN1.2 3.88,27.48 D1.2
  vias: v2(17.07,41.91) v2(17.07,40.64) v2(17.07,39.48) v2(17.07,38.23) v2(17.09,37.17) v2(17.07,36.07) v2(17.07,34.8) v2(17.07,33.78) v2(17.07,32.77) v2(17.07,31.75) v2(17.89,41.91) v2(17.89,40.64) v2(17.89,39.48) v2(17.89,38.23) v2(17.91,37.17) v2(17.89,36.07) v2(17.89,34.8) v2(17.89,33.78) v2(17.89,32.77) v2(17.89,31.75) v2(18.71,41.91) v2(18.71,40.64) v2(18.71,39.48) v2(18.71,38.23) v2(18.72,37.17) v2(18.71,36.07) v2(18.71,34.8) v2(18.71,33.78) v2(18.71,32.77) v2(18.71,31.75) v2(19.53,41.91) v2(19.53,40.64) v2(19.53,39.48) v2(19.53,38.23) v2(19.53,36.07) v2(19.53,34.8) v2(19.53,33.78) v2(19.53,32.77) v2(19.53,31.75) v2(19.54,37.17) v2(20.35,41.91) v2(20.35,40.64) v2(20.35,39.48) v2(20.35,38.23) v2(20.36,37.17) v2(20.35,36.07) v2(20.35,34.8) v2(20.35,33.78) v2(20.35,32.77) v2(20.35,31.75) v2(21.16,41.91) v2(21.16,40.64) v2(21.16,39.48) v2(21.16,38.23) v2(21.18,37.17) v2(21.16,36.07) v2(21.16,34.8) v2(21.16,33.78) v2(21.16,32.77) v2(21.16,31.75) v2(21.98,41.91) v2(21.98,40.64) v2(21.98,39.48) v2(21.98,38.23) v2(22,37.17) v2(21.98,36.07) v2(21.98,34.8) v2(21.98,33.78) v2(21.98,32.77) v2(21.98,31.75) v2(22.8,41.91) v2(22.8,40.64) v2(22.8,39.48) v2(22.8,38.23) v2(22.81,37.17) v2(22.8,36.07) v2(22.8,34.8) v2(22.8,33.78) v2(22.8,32.77) v2(22.8,31.75) v2(23.62,41.91) v2(23.62,40.64) v2(23.62,39.48) v2(23.62,38.23) v2(23.62,36.07) v2(23.62,34.8) v2(23.62,33.78) v2(23.62,32.77) v2(23.62,31.75) v2(23.63,37.17) v2(24.44,41.91) v2(24.44,40.64) v2(24.44,39.48) v2(24.44,38.23) v2(24.45,37.17) v2(24.44,36.07) v2(24.44,34.8) v2(24.44,33.78) v2(24.44,32.77) v2(24.44,31.75) v2(25.25,41.91) v2(25.25,40.64) v2(25.25,39.48) v2(25.25,38.23) v2(25.27,37.17) v2(25.25,36.07) v2(25.25,34.8) v2(25.25,33.78) v2(25.25,32.77) v2(25.25,31.75) v2(26.07,41.91) v2(26.07,40.64) v2(26.07,39.48) v2(26.07,38.23) v2(26.09,37.17) v2(26.07,36.07) v2(26.07,34.8) v2(26.07,33.78) v2(26.07,32.77) v2(26.07,31.75)
3.3A: length 28.6
  Bottom Layer w0.102: 70.74,5.58 70.74,8.13 71,8.39 U13.37 ; 70.74,5.58 70.94,5.39 U13.43 ; 70.74,5.58 70.74,3.89 ; 70.74,2.92 69.72,2.92 ; 70.74,2.92 70.84,2.82 U13.1 ; 70.74,2.92 70.74,2.92 70.74,3.89 ; 69.72,2.92 69.85,2.79 69.85,2.33 U13.3 ; 69.72,2.92 69.47,2.92 ; 70.74,3.89 70.75,3.89 71.41,3.89 ; U13.4 69.34,2.32 69.34,2.79 69.47,2.92 ; 69.47,2.92 65.53,2.92 65.4,3.05 65.4,5.72 65.23,5.89 64.77,5.89
  Bottom Layer w0.254: C62.2 C63.2 68.57,11.81 R60.1 71.12,13.21 72.14,12.19 72.14,8.64 71.89,8.39 U13.37
BOOT2: length 10.9
  Top Layer w0.152: 45.27,23.62 45.27,22.79 44.96,22.48 43.18,22.48 42.95,22.25 42.94,22.25 42.55,21.85 42.55,21.08 42.04,20.57 41.18,20.57 C31.2 40.39,19.63 40.39,18.79 39.56,17.96 U6.20
BTN: length 32.2
  Top Layer w0.102: 86.11,13.59 86.11,15.15 C80.2
  Top Layer w0.152: 86.11,13.59 86.11,12.19 86.7,11.59 86.78,11.59 ; R75.1 81.74,10.04 81.15,10.62 77.55,10.62 76.33,9.4 76.33,7.36 v2(69.6,0.63)
  Top Layer w0.254: SW2.2 86.78,11.59 86.11,10.92 86.11,10.2 85.37,9.47 83.75,9.47 83.19,10.03 R75.1
  Bottom Layer w0.152: 69.47,0.51 68.96,0.51 68.37,1.1 68.37,2.28 U13.6
BUZZER: length 4
  Bottom Layer w0.102: 64.77,6.89 63.86,6.89 R70.1
CC1: length 9.4
  Top Layer w0.152: USB1.A5 v2(4.95,42.43) ; U3.7 10.1,39.17 v2(9.78,39.5)
  Bottom Layer w0.152: v2(4.95,42.43) 7.86,42.43 9.78,40.51 v2(9.78,39.5)
CC2: length 8.5
  Top Layer w0.152: v2(9.14,36.96) 9.14,38.09 U3.6 ; USB1.B5 4.95,39.43
  Bottom Layer w0.152: v2(9.14,36.96) 9.14,38.35 8.08,39.42 v2(4.95,39.42)
CC_LOOP: length 43.2
  Top Layer w0.152: v1(51.18,13.97) 51.18,15.97 R44.2 ; C58.2 52.14,16.93 R44.2 ; U11.7 56.45,15.69 56.01,16.13 52.64,16.13 R44.2 ; 52.96,10.8 52.07,9.91 52.07,9.04 D8.2 52.07,8.36 52.07,1.65 53.34,0.38 67.3,0.38 67.31,0.38 67.82,0.38 68.04,0.6 v2(68.09,0.6)
  内层1 w0.152: 52.78,10.92 51.82,10.92 51.18,11.56 v1(51.18,13.97)
  Bottom Layer w0.152: v2(68.09,0.6) 68.09,1.38 67.84,1.63 U13.7
  vias: v1(53.09,10.92)
COMP: length 22.4
  Top Layer w0.152: D8.1 49.13,8.64 v1(48.26,8.64) ; v1(43.05,13.34) 43.05,12.95 42.29,12.19 39.88,12.19 39.56,11.87 U6.9 39.56,8.96 40.39,8.13 40.39,6.17 C27.2 41.8,6.12 R17.2
  Bottom Layer w0.152: Q4.3 42.55,12.83 v1(43.05,13.34) 45.59,13.34 48.01,10.92 48.01,8.89 48.2,8.7
CS: length 26.1
  Top Layer w0.152: R26.2 39.02,27.94 39.66,27.31 46.1,27.31 v2(46.36,27.05) ; R18.2 46.61,21.58 v2(46.61,22.48)
  Bottom Layer w0.152: v2(46.61,22.48) 46.36,22.73 v2(46.36,27.05)
  Bottom Layer w0.381: D5.2 27.94,44.47 27.94,37.85 30.61,35.18
  vias: v2(29.34,30.57) v2(29.34,29.89) v2(29.59,29.17) v2(30.11,30.57) v2(30.12,29.89) v2(30.37,29.17) v2(30.89,30.57) v2(30.89,29.89) v2(31.14,29.17) v2(31.66,30.57) v2(31.67,29.89) v2(31.92,29.17) v2(32.44,30.57) v2(32.44,29.89) v2(32.69,29.17) v2(33.21,30.57) v2(33.22,29.89) v2(33.47,29.17) v2(33.99,30.57) v2(33.99,29.89) v2(34.24,29.17) v2(34.8,35.18) v2(34.8,34.31) v2(34.8,33.5) v2(34.8,32.77) v2(34.8,31.92) v2(34.77,30.57) v2(34.77,29.89) v2(35.02,29.17) v2(35.54,30.57) v2(35.54,29.89) v2(35.77,35.19) v2(35.77,34.33) v2(35.77,33.43) v2(35.77,32.72) v2(35.77,31.9) v2(35.79,29.17) v2(36.83,35.18) v2(36.83,34.33) v2(36.83,31.88) v2(36.86,33.43) v2(36.86,32.72) v2(37.09,29.89) v2(37.34,29.17) v2(37.87,30.57) v2(37.87,29.89) v2(38.12,29.17) v2(38.73,30.57) v2(38.74,29.89) v2(38.99,29.17) v2(39.69,30.57) v2(39.69,29.89) v2(39.94,29.17) v2(40.64,30.57) v2(40.64,29.89) v2(40.89,29.17) v2(41.59,30.57) v2(41.59,29.89) v2(41.84,29.17) v2(42.54,30.57) v2(42.54,29.89) v2(42.79,29.17) v2(46.1,34.92) v2(46.1,34.05) v2(46.1,33.24) v2(46.1,32.51) v2(46.1,31.67) v2(47.07,34.93) v2(47.07,34.07) v2(47.07,33.17) v2(47.07,32.47) v2(47.07,31.64) v2(48.13,34.92) v2(48.13,34.07) v2(48.16,33.17) v2(48.16,32.47) v2(48.13,31.62)
CS_N: length 9.9
  Top Layer w0.152: R19.1 47.88,18.01 arc(47.81,17.68) 47.62,17.4 47.54,17.32 arc(46.72,16.77) 45.75,16.57 C29.1 44.96,15.67 arc(44.92,15.51) 44.83,15.37 arc(44.55,15.18) 44.22,15.11 43.81,15.11 arc(43.58,15.16) 43.38,15.29 43.18,15.49 arc(42.9,15.91) 42.81,16.39 U6.15
CS_P: length 6.7
  Top Layer w0.152: R18.1 46.48,19.03 arc(46.42,18.7) 46.23,18.42 arc(45.74,18.09) 45.16,17.97 C29.2 42.88,17.97 arc(42.63,17.92) 42.42,17.78 arc(42.23,17.49) 42.16,17.15 U6.16
D/C: length 17
  Bottom Layer w0.102: FPC1.4 54.75,9.89 56.21,8.43 56.21,7 56.86,6.35 60.71,6.35 61.85,5.21 61.85,4.32 62.28,3.89 64.77,3.89
DAC_CLR: length 12.5
  Top Layer w0.102: v2(55.89,10.29) 56.01,10.29 56.4,10.68 57.29,10.68
  Bottom Layer w0.102: U13.18 63.95,5.39 61.59,7.75 58.43,7.75 v2(55.89,10.29)
DAC_CS: length 11.5
  Top Layer w0.152: U16.6 62,10.67 62.61,10.67 62.86,10.41 62.86,8.76 63.5,8.13 66.55,8.13 68.38,9.96 v2(69.65,9.96)
  Bottom Layer w0.152: U13.34 69.84,9.77 v2(69.65,9.96)
DAC_LDAC: length 14.8
  Top Layer w0.102: 57.29,11.18 57.18,11.07 55.95,11.07 55.28,10.4 v2(54.81,10.4)
  Bottom Layer w0.102: U13.20 63.71,6.39 61.98,8.13 59.01,8.13 56.34,10.8 55.51,10.8 55.11,10.4 v2(54.81,10.4)
DTR: length 40.4
  Top Layer w0.152: U14.13 20.19,2.71 20.19,1.14 20.95,0.38 51.87,0.38 v1(52.07,0.58)
  Bottom Layer w0.152: R62.2 47.5,0.76 47.68,0.58 v1(52.07,0.58) 52.32,0.83 Q6.4
EC11_S1: length 22.1
  Top Layer w0.152: SW1.D 81.66,18.25 C78.2 81.3,17.82 R67.1
  Bottom Layer w0.102: 71.41,7.89 74.82,7.89 81.66,14.73 SW1.D
EN: length 22.7
  Bottom Layer w0.152: 53.32,2.18 R61.1 56.09,3.49 C64.2 ; 53.32,2.18 53.59,1.91 53.59,1.14 54.23,0.51 65.79,0.51 66.84,1.55 U13.9 ; 53.32,2.18 53.3,2.16 51.48,2.16 51.02,1.69 Q6.6
FAN: length 4.1
  Bottom Layer w0.152: 64.13,11.81 63.88,11.56 63.88,8.89 64.38,8.39 U13.24
HO1: length 7
  Top Layer w0.152: v1(33.78,21.97) 33.28,21.97 33.27,21.97 R27.1 ; v1(34.61,18.47) 35.01,18.08 U6.27
  Bottom Layer w0.152: v1(33.78,21.97) 34.61,21.14 v1(34.61,18.47)
HO2: length 48.8
  Top Layer w0.152: R29.2 64.52,44.2 v1(64.01,43.69) ; U6.19 40.21,17.86 v2(40.51,18.16)
  Bottom Layer w0.152: v2(40.51,18.16) 43.05,20.7 46.36,20.7 47.12,21.46 47.12,22.23 47.14,22.26 47.14,22.7 47.12,22.73 47.12,26.8 50.17,29.84 50.17,42.16 51.56,43.56 63.75,43.56 64.01,43.81
IO0: length 61.3
  Top Layer w0.152: v1(30.35,1.91) 30.18,2.08 30.18,3.94 29.22,3.94 29.08,4.07 29.08,5.07 29.49,5.48 29.49,6.21 29.83,6.21 29.84,6.22 29.84,6.6 31.62,8.38 32.89,8.38 34.36,9.85 U6.1
  Bottom Layer w0.152: 49.4,7.49 48.91,7.49 43.83,2.41 36.09,2.41 36.09,2.42 35.03,2.42 35.03,2.41 32.64,2.41 32.13,1.91 v1(30.35,1.91) ; 49.4,7.49 49.4,10.67 50.77,12.04 60.61,12.04 63.12,9.53 63.12,8.89 64.12,7.89 64.77,7.89 ; 49.4,7.49 49.4,7.38 52.32,4.46 52.32,3.31 Q6.3
IS_N: length 3.8
  Top Layer w0.102: 64.26,22.35 63.89,21.98 U10.3 ; 64.26,22.35 C54.1
  Top Layer w0.152: C54.1 66.26,22.35 R40.2
IS_P: length 3.8
  Top Layer w0.102: U10.2 63.89,21.33 64.26,20.95 C54.2
  Top Layer w0.152: R39.2 66.26,20.95 C54.2
ISENSE: length 40.3
  Top Layer w0.152: v1(64.42,1.12) 64.9,0.64 65.92,0.64 72.01,6.72 72.01,15.37 71.5,15.87 v1(71.5,17.73) ; U10.8 57.68,20.68 58.04,20.32 58.04,19.05 58.3,18.79 v2(58.81,18.79)
  Bottom Layer w0.152: v1(71.5,17.73) 70.45,18.79 v2(58.81,18.79) ; v1(64.42,1.12) 64.85,1.55 65.37,1.55 65.84,2.02 U13.11
ISET: length 3.6
  Top Layer w0.152: 57.29,12.18 55.61,12.18 R42.1 R43.2
LCD_CS: length 16.3
  Bottom Layer w0.102: FPC1.5 54.74,9.39 56.01,8.13 56.01,6.91 56.9,6.02 59.26,6.02 61.89,3.39 U13.14
LCD_LED: length 4.9
  Bottom Layer w0.102: 64.77,4.89 63.95,4.89 61.85,6.98 R74.1
LED_G: length 42.3
  Top Layer w0.102: v1(80.14,14.73) 82.42,12.45
  Top Layer w0.152: 84.91,7.17 v1(86.36,7.17)
  Bottom Layer w0.102: v1(80.14,14.73) 80.14,14.86 79.76,15.24 72.77,15.24 71.07,16.94 65.04,16.94 64.52,16.42 64.52,12.58 64.62,12.48 64.62,11.46 65.35,10.72 65.35,10.08 65.66,9.78 66.93,9.78 67.34,9.37 U13.29 ; v1(82.42,12.7) 82.42,7.75 83.31,6.86 87.27,6.86 R77.2
  Bottom Layer w0.152: v1(86.36,7.17) 87.21,7.17 R77.2
LED_R: length 40.9
  Top Layer w0.102: v1(80.9,15.24) v1(82.93,13.21)
  Top Layer w0.152: 84.91,8.17 v1(86.49,8.17)
  Bottom Layer w0.102: U13.28 66.84,9.36 66.67,9.53 65.53,9.53 65.13,9.93 65.13,10.57 64.36,11.33 64.36,12.44 64.26,12.54 64.26,16.51 64.9,17.14 71.37,17.14 72.9,15.62 80.52,15.62 80.77,15.37 ; v1(82.93,13.21) 82.93,9.4 83.31,9.02 87.32,9.02
  Bottom Layer w0.152: v1(86.49,8.17) 87.4,9.08 R76.2
LO1: length 16.2
  Top Layer w0.152: U6.25 36.31,20.07
  Bottom Layer w0.152: v2(36.32,20.22) 36.32,28.94 36.33,28.95 36.33,29.39 36.32,29.4 36.32,30.23 v2(38.35,32.26)
LO2: length 18.3
  Top Layer w0.152: R30.2 46.61,29.03 v2(46.57,29) ; U6.21 38.91,18.21 v2(39.12,18.42)
  Bottom Layer w0.152: v2(39.12,18.42) 41.78,21.08 45.59,21.08 45.82,21.31 45.82,28.18 46.61,28.97
MOSI: length 25.5
  Top Layer w0.102: U16.8 59.97,11.68 57.82,9.53 54.24,9.53 v1(53.47,8.76)
  Top Layer w0.152: U16.8 62.86,11.68 63.63,10.92 63.63,9.27 64.01,8.89 66.04,8.89 68.29,11.14 v2(70.65,11.14)
  Bottom Layer w0.102: FPC1.6 53.47,8.89
  Bottom Layer w0.152: v2(70.65,11.14) 70.84,10.95 U13.36
PCNT_A: length 17.4
  Top Layer w0.254: SW1.A 81.66,5.72 80.3,7.08 C76.1 80.3,9.94 R68.2
  Bottom Layer w0.102: U13.39 72.03,7.39 72.14,7.49 80.77,7.49 81.66,6.6 SW1.A
PCNT_B: length 11.1
  Top Layer w0.152: R69.1 78.82,9.62 C77.2 77.22,8.02 77.22,5.83 SW1.B
  Bottom Layer w0.102: 71.41,5.89 72.72,5.89 73.42,5.2 SW1.B
PG: length 14.1
  Top Layer w0.152: LED1.2 49.72,23.75 R32.1 48.64,23.59 48.64,20.95 48.39,20.7 46.08,20.7 45.59,20.22 45.59,19.3 45.08,18.8 44.61,18.8 44.23,18.42 42.16,18.42 41.53,17.78 41.53,16.74 U6.17
PWMA: length 7
  Bottom Layer w0.152: 64.77,2.89 60.99,2.89 60.34,3.54 60.34,4.55 59.94,4.95 59.18,4.95
  vias: v2(59.05,4.87)
PWMB: length 11.9
  Top Layer w0.152: v1(55.12,1.25) 54.3,2.07 C72.1
  Bottom Layer w0.102: U13.12 65.34,2.22 64.9,1.78 58.32,1.78 57.79,1.25 v1(55.12,1.25)
PWR_IN: length 19.6
  Top Layer w0.152: R65.1 52.81,4.29 C67.2 52.74,4.21 R64.1 52.74,1.62 53.72,0.64 62.99,0.64 64.01,1.65 65.15,1.65 65.66,1.14 v1(65.71,1.14)
  Bottom Layer w0.102: U13.10 66.34,1.7 65.79,1.14 v1(65.71,1.14)
RTS: length 34.3
  Top Layer w0.152: U14.14 21.33,1.53 22.22,0.64 49.28,0.64 50.17,1.52 50.17,3.05
  Bottom Layer w0.152: Q6.1 51.01,3.3 50.67,3.3 50.41,3.04 v1(50.13,3.04) R63.1
RXD: length 62.8
  Top Layer w0.152: v1(44.2,1.4) 43.69,0.89 22.61,0.89 21.97,1.52 21.97,6.1 21.33,6.73 U14.3
  内层1 w0.152: v1(44.2,1.4) 44.55,1.75 68.68,1.75 v2(73.28,6.35)
  Bottom Layer w0.152: U13.41 73.02,6.39
SCLK: length 24.4
  Top Layer w0.102: v1(58.93,9.96) 60.15,11.18 U16.7
  Top Layer w0.152: U16.7 62.86,11.18 63.25,10.8 63.25,9.02 63.75,8.51 66.29,8.51 68.28,10.49 v2(70.21,10.49)
  Bottom Layer w0.102: FPC1.3 53.95,10.39 54.73,11.17 56.4,11.17 57.6,9.96 v1(58.93,9.96)
  Bottom Layer w0.152: v2(70.21,10.49) 70.34,10.37 U13.35
SW1: length 27.2
  Top Layer w0.381: U6.28 34.36,17.68 C30.1 C33.2
  Top Layer w0.508: C33.2 31.5,18.89 v1(31.5,18.03)
  内层1 w0.508: v2(29.21,38.1) 28.07,36.96 28.07,21.46 v1(31.5,18.03)
  vias: v2(28.7,48.77) v2(29.21,44.96) v2(29.21,44.07) v2(29.21,43.05) v2(29.21,42.04) v2(29.21,41.02) v2(29.21,40) v2(29.21,38.99) v2(29.72,48.77) v2(30.23,45.97) v2(30.23,44.96) v2(30.23,44.07) v2(30.23,43.05) v2(30.23,42.04) v2(30.23,41.02) v2(30.23,40) v2(30.23,38.99) v2(30.23,38.1) v2(30.75,48.77) v2(31.25,45.97) v2(31.25,44.96) v2(31.25,44.07) v2(31.25,43.05) v2(31.25,42.04) v2(31.25,41.02) v2(31.25,40) v2(31.25,38.99) v2(31.25,38.1) v2(31.77,48.77) v2(32.27,45.97) v2(32.27,44.96) v2(32.27,44.07) v2(32.27,43.05) v2(32.27,42.04) v2(32.27,41.02) v2(32.27,40) v2(32.27,38.99) v2(32.27,38.1) v2(32.79,48.77) v2(33.29,45.97) v2(33.29,44.96) v2(33.29,44.07) v2(33.29,43.05) v2(33.29,42.04) v2(33.29,41.02) v2(33.29,40) v2(33.29,38.99) v2(33.29,38.1) v2(33.81,48.77) v2(34.31,45.97) v2(34.31,44.96) v2(34.31,44.07) v2(34.31,43.05) v2(34.31,42.04) v2(34.31,41.02) v2(34.31,40) v2(34.31,38.99) v2(34.31,38.1) v2(34.83,48.77) v2(35.33,45.97) v2(35.33,44.96) v2(35.33,44.07) v2(35.33,43.05) v2(35.33,42.04) v2(35.33,41.02) v2(35.33,40) v2(35.33,38.99) v2(35.33,38.1) v2(35.85,48.77) v2(36.35,45.97) v2(36.35,44.96) v2(36.35,44.07) v2(36.35,43.05) v2(36.35,42.04) v2(36.35,41.02) v2(36.35,40) v2(36.35,38.99) v2(36.35,38.1) v2(36.88,48.77) v2(37.37,45.97) v2(37.37,44.96) v2(37.37,44.07) v2(37.37,43.05) v2(37.37,42.04) v2(37.37,41.02) v2(37.37,40) v2(37.37,38.99) v2(37.37,38.1) v2(37.9,48.77)
SW2: length 28.1
  Top Layer w0.152: C34.2 43.3,19.7 C31.1 41.71,18.6 40.86,17.74 U6.18
  内层1 w0.152: v1(43.31,19.81) 44.2,20.7 44.2,26.92 45.07,27.79 48.62,27.79 49.66,28.83 49.66,37.77 v2(49.33,38.1)
  vias: v2(40.13,45.97) v2(40.13,44.96) v2(40.13,44.07) v2(40.13,43.05) v2(40.13,42.04) v2(40.13,41.02) v2(40.13,40) v2(40.13,38.99) v2(40.13,38.1) v2(40.51,48.64) v2(41.15,45.97) v2(41.15,44.96) v2(41.15,44.07) v2(41.15,43.05) v2(41.15,42.04) v2(41.15,41.02) v2(41.15,40) v2(41.15,38.99) v2(41.15,38.1) v2(41.54,48.64) v2(42.18,45.97) v2(42.18,44.96) v2(42.18,44.07) v2(42.18,43.05) v2(42.18,42.04) v2(42.18,41.02) v2(42.18,40) v2(42.18,38.99) v2(42.18,38.1) v2(42.56,48.64) v2(43.2,45.97) v2(43.2,44.96) v2(43.2,44.07) v2(43.2,43.05) v2(43.2,42.04) v2(43.2,41.02) v2(43.2,40) v2(43.2,38.99) v2(43.2,38.1) v2(43.58,48.64) v2(44.22,45.97) v2(44.22,44.96) v2(44.22,44.07) v2(44.22,43.05) v2(44.22,42.04) v2(44.22,41.02) v2(44.22,40) v2(44.22,38.99) v2(44.22,38.1) v2(44.6,48.64) v2(45.24,45.97) v2(45.24,44.96) v2(45.24,44.07) v2(45.24,43.05) v2(45.24,42.04) v2(45.24,41.02) v2(45.24,40) v2(45.24,38.99) v2(45.24,38.1) v2(45.62,48.64) v2(46.26,45.97) v2(46.26,44.96) v2(46.26,44.07) v2(46.26,43.05) v2(46.26,42.04) v2(46.26,41.02) v2(46.26,40) v2(46.26,38.99) v2(46.26,38.1) v2(46.64,48.64) v2(47.28,45.97) v2(47.28,44.96) v2(47.28,44.07) v2(47.28,43.05) v2(47.28,42.04) v2(47.28,41.02) v2(47.28,40) v2(47.28,38.99) v2(47.28,38.1) v2(47.67,48.64) v2(48.31,45.97) v2(48.31,44.96) v2(48.31,44.07) v2(48.31,43.05) v2(48.31,42.04) v2(48.31,41.02) v2(48.31,40) v2(48.31,38.99) v2(48.31,38.1) v2(48.69,48.64) v2(49.33,45.97) v2(49.33,44.96) v2(49.33,44.07) v2(49.33,43.05) v2(49.33,42.04) v2(49.33,41.02) v2(49.33,40) v2(49.33,38.99) v2(49.71,48.64) v2(51.69,48.51) v2(51.69,47.64) v2(51.69,46.83) v2(51.69,46.1) v2(51.69,45.26) v2(52.66,48.52) v2(52.66,47.66) v2(52.66,46.76) v2(52.66,46.06) v2(52.66,45.23) v2(53.72,48.51) v2(53.72,47.66) v2(53.72,45.21) v2(53.75,46.76) v2(53.75,46.06)
TEMP: length 19.1
  Top Layer w0.152: R72.2 78.02,14.2 ; 78.02,14.2 R73.1 ; 78.02,14.2 77.98,14.15 77.98,12.96 C79.2 75.82,10.8 75.82,7.49 69.85,1.52 v2(69.6,1.52)
  Bottom Layer w0.152: v2(69.6,1.52) 69.21,1.52 68.84,1.9 U13.5
TXD: length 60.4
  Top Layer w0.152: 41.02,1.65 40.51,1.14 24,1.14 23.11,2.03 23.11,3.81 22.6,4.32 U14.2
  内层1 w0.152: 40.89,1.52 41.38,2.01 67.67,2.01 v2(72.64,6.98)
  Bottom Layer w0.152: 71.41,6.89 72.52,6.89
  vias: v1(41.03,1.65)
USB_N: length 50.9
  Top Layer w0.152: 18.01,10.41 18.01,9.88 17.52,9.4 U14.6 ; 6.35,41.81 5.35,41.81 5.25,41.71 4.19,41.71 3.15,40.67 3.15,24.33 2.54,23.72 2.54,20.06 ; 6.35,41.81 USB1.B7 ; 6.35,41.81 6.97,41.81 7.1,41.68 7.1,41.19 6.92,41 6.29,41 USB1.A7
  Bottom Layer w0.152: v2(17.78,10.54) 17.78,11 18.01,11.23 18.01,11.42 15.46,13.97 4.83,13.97 3.05,15.75 3.05,16.68 3.15,16.78 3.15,17.93 2.54,18.54 2.54,19.57
  vias: v2(2.41,19.81)
USB_P: length 49.5
  Top Layer w0.152: U14.5 18.79,9.53 18.41,9.91 18.41,10.45 v2(18.54,10.58) ; USB1.A6 6.1,41.31 5.48,41.31 5.35,41.18 5.35,40.69 5.48,40.56 6.1,40.56 USB1.B6 ; 5.39,41.22 5.39,41.3 5.29,41.41 4.45,41.41 3.46,40.42 3.46,24.08 3.12,23.74 3.12,19.94
  Bottom Layer w0.152: v2(18.54,10.58) 18.54,11.04 18.31,11.27 18.31,11.54 15.58,14.27 4.95,14.27 3.35,15.88 3.35,16.55 3.46,16.66 3.46,18.31 3.17,18.59 v2(3.17,19.69)
USET: length 16.7
  Top Layer w0.102: R13.1 44.8,4.97 45.16,5.33 47.32,5.33 50.04,8.05 50.04,9.27 53.21,12.45 56.26,12.45 56.5,12.68 57.29,12.68
VO:
  vias: v2(51.18,41.66) v2(51.18,40.59) v2(51.18,39.55) v2(51.18,38.57) v2(51.18,37.7) v2(51.18,33.11) v2(51.18,32.22) v2(51.26,36.86) v2(51.26,35.85) v2(51.26,34.93) v2(51.26,34.03) v2(51.96,41.66) v2(51.96,40.59) v2(51.96,39.55) v2(51.96,38.57) v2(51.96,37.7) v2(51.96,33.11) v2(51.96,32.22) v2(52.03,36.86) v2(52.03,35.85) v2(52.03,34.93) v2(52.03,34.03) v2(52.73,41.66) v2(52.73,40.59) v2(52.73,39.55) v2(52.73,38.57) v2(52.73,37.7) v2(52.81,36.86) v2(52.81,35.85) v2(52.81,34.93) v2(52.81,34.03) v2(52.73,33.11) v2(52.73,32.22) v2(53.51,41.66) v2(53.51,40.59) v2(53.51,39.55) v2(53.51,38.57) v2(53.51,37.7) v2(53.51,33.11) v2(53.51,32.22) v2(53.58,36.86) v2(53.58,35.85) v2(53.58,34.93) v2(53.58,34.03) v2(54.28,41.66) v2(54.28,40.59) v2(54.28,39.55) v2(54.28,38.57) v2(54.28,37.7) v2(54.28,33.11) v2(54.28,32.22) v2(54.36,36.86) v2(54.36,35.85) v2(54.36,34.93) v2(54.36,34.03) v2(55.06,41.66) v2(55.06,40.59) v2(55.06,39.55) v2(55.06,38.57) v2(55.06,37.7) v2(55.06,33.11) v2(55.06,32.22) v2(55.13,36.86) v2(55.13,35.85) v2(55.13,34.93) v2(55.13,34.03) v2(55.83,41.66) v2(55.83,40.59) v2(55.83,39.55) v2(55.83,38.57) v2(55.83,37.7) v2(55.91,36.86) v2(55.91,35.85) v2(55.91,34.93) v2(55.91,34.03) v2(55.83,33.11) v2(55.83,32.22) v2(56.61,41.66) v2(56.61,40.59) v2(56.61,39.55) v2(56.61,38.57) v2(56.61,37.7) v2(56.61,33.11) v2(56.61,32.22) v2(56.68,36.86) v2(56.68,35.85) v2(56.68,34.93) v2(56.68,34.03) v2(57.38,41.66) v2(57.38,40.59) v2(57.38,39.55) v2(57.38,38.57) v2(57.38,37.7) v2(57.38,33.11) v2(57.38,32.22) v2(57.46,36.86) v2(57.46,35.85) v2(57.46,34.93) v2(57.46,34.03) v2(58.16,41.66) v2(58.16,40.59) v2(58.16,39.55) v2(58.16,38.57) v2(58.16,37.7) v2(58.16,33.11) v2(58.16,32.22) v2(58.24,36.86) v2(58.24,35.85) v2(58.24,34.93) v2(58.24,34.03) v2(58.93,41.66) v2(58.93,40.59) v2(58.93,39.55) v2(58.93,38.57) v2(58.93,37.7) v2(59.01,36.86) v2(59.01,35.85) v2(59.01,34.93) v2(59.01,34.03) v2(58.93,33.11) v2(58.93,32.22) v2(59.71,41.66) v2(59.71,40.59) v2(59.71,39.55) v2(59.71,38.57) v2(59.71,37.7) v2(59.71,33.11) v2(59.71,32.22) v2(59.79,36.86) v2(59.79,35.85) v2(59.79,34.93) v2(59.79,34.03) v2(60.58,38.57) v2(60.58,37.7) v2(60.58,33.11) v2(60.58,32.22) v2(60.65,36.86) v2(60.65,35.85) v2(60.65,34.93) v2(60.65,34.03) v2(61.53,38.57) v2(61.53,37.7) v2(61.53,33.11) v2(61.53,32.22) v2(61.61,36.86) v2(61.61,35.85) v2(61.61,34.93) v2(61.61,34.03) v2(62.48,38.57) v2(62.48,37.7) v2(62.48,33.11) v2(62.48,32.22) v2(62.56,36.86) v2(62.56,35.85) v2(62.56,34.93) v2(62.56,34.03) v2(63.43,38.57) v2(63.43,37.7) v2(63.51,36.86) v2(63.51,35.85) v2(63.51,34.93) v2(63.51,34.03) v2(63.43,33.11) v2(63.43,32.22) v2(64.38,38.57) v2(64.38,37.7) v2(64.38,33.11) v2(64.38,32.22) v2(64.46,36.86) v2(64.46,35.85) v2(64.46,34.93) v2(64.46,34.03)
VOS: length 62.9
  Top Layer w0.102: R12.2 43.58,4.94 43.58,5.22 43.94,5.59 47.29,5.59 49.83,8.14 49.83,9.35 53.13,12.65 53.16,12.65 53.21,12.7 56.19,12.7 58.53,15.04 U11.1
  Top Layer w0.152: U11.1 63.19,15.04 63.57,14.66 R47.2 65.16,13.97 66.55,13.97 66.93,13.59 68.71,13.59 69.34,14.22 69.85,14.22 70.47,14.84 70.47,17.42 71.29,18.24 73.07,18.24 75.18,16.13 75.18,7.37 70.1,2.29 68.58,2.29 67.31,1.02 v2(67.06,1.02)
  Bottom Layer w0.102: v2(67.06,1.02) 67.06,1.4 67.33,1.67 67.33,2.31 U13.8
VOUT: length 72.8
  Top Layer w0.152: v2(68.83,21.97) 68.22,21.97 R40.1 67.17,21.76 67.17,19.34 v1(67.21,19.3) ; R36.2 83.69,38.86 v2(83.18,38.36) ; 47.62,13.08 47.62,9.47 R15.1
  内层1 w0.152: v2(47.62,13.14) 47.62,14.86 54.74,21.97 v2(68.83,21.97) 81.03,21.97 83.18,24.13 v2(83.18,38.36)
  Bottom Layer w0.152: R53.2 48.9,17.15 47.62,15.88 v2(47.62,13.14)
  vias: v1(83.18,48.11) v1(83.18,46.94) v1(83.18,45.76) v1(83.18,44.59) v1(83.18,43.16) v1(83.18,41.99) v1(83.18,40.81) v1(83.18,39.64) v1(84.07,48.13) v1(84.07,46.96) v1(84.07,45.78) v1(84.07,44.61) v1(84.07,43.18) v1(84.07,42) v1(84.07,40.83) v1(84.07,39.66) v1(86.87,48.26) v1(86.87,47.09) v1(86.87,45.91) v1(86.87,44.74) v1(86.87,43.31) v1(86.87,42.13) v1(86.87,40.96) v1(86.87,39.78)
VOUTP: length 82.1
  Top Layer w0.152: v2(81.79,38.35) 81.28,38.86 R36.1 ; v2(70.21,22.61) 70.19,22.59 70.19,21.8 69.3,20.92 R39.1 ; U6.12 41.53,10.97 41.53,9.4 43.75,7.18 45.02,7.18 45.47,7.62 45.47,8.77 R16.1 47.24,10.55 47.24,12.77 46.86,13.15 46.86,14.1 v2(46.89,14.12)
  Top Layer w0.762: 72.39,36.83 71.63,36.07 71.63,32.09 C39.1
  内层1 w0.152: v2(81.79,38.35) 81.79,23.5 80.9,22.61 v2(70.21,22.61) 54.23,22.61 46.99,15.37 46.99,14.23 v2(46.89,14.12)
  vias: v1(66.67,48.39) v1(66.67,47.24) v1(66.67,46.1) v1(66.67,44.87) v1(66.67,43.69) v1(66.67,42.42) v1(66.67,41.4) v1(66.67,40.26) v1(66.67,38.73) v1(67.91,48.39) v1(67.91,47.24) v1(67.91,46.1) v1(67.91,44.87) v1(67.91,43.69) v1(67.91,42.42) v1(67.91,41.4) v1(67.91,40.26) v1(67.91,38.73) v1(69.15,48.39) v1(69.15,47.24) v1(69.15,46.1) v1(69.15,44.87) v1(69.15,43.69) v1(69.15,42.42) v1(69.15,41.4) v1(69.15,40.26) v1(69.15,38.73) v1(70.39,48.39) v1(70.39,47.24) v1(70.39,46.1) v1(70.39,44.87) v1(70.39,43.69) v1(70.39,42.42) v1(70.39,41.4) v1(70.39,40.26) v1(70.39,38.73) v1(71.62,48.39) v1(71.62,47.24) v1(71.62,46.1) v1(71.62,44.87) v1(71.62,43.69) v1(71.62,42.42) v1(71.62,41.4) v1(71.62,40.26) v1(71.62,38.73) v1(72.86,48.39) v1(72.86,47.24) v1(72.86,46.1) v1(72.86,44.87) v1(72.86,43.69) v1(72.86,42.42) v1(72.86,38.73) v1(74.1,48.39) v1(74.1,47.24) v1(74.1,46.1) v1(74.13,44.83) v1(74.1,43.69) v1(74.1,42.42) v1(74.1,38.73) v1(75.3,44.7) v1(75.3,43.69) v1(75.31,42.42) v1(75.33,48.39) v1(75.33,47.24) v1(75.33,38.73) v1(76.57,48.39) v1(76.57,43.69) v1(76.54,42.42) v1(76.54,40.39) v1(77.81,48.39) v1(77.81,47.24) v1(77.81,44.87) v1(77.81,43.69) v1(77.81,42.42)
VREF: length 5.9
  Top Layer w0.152: R66.2 66.8,12.46 U15.2 70.99,12.46 C69.2
$1N730: length 18.7
  Top Layer w0.152: D2.1 17.34,24.36 R2.2 16.51,24.26 15.75,23.5 15.32,23.5 R1.1
  Top Layer w0.762: 25.08,12.8 24.16,12.8 21.46,15.49 21.46,20.24 D2.1
$1N1359: length 5.3
  Bottom Layer w1.016: CN1.1 4.13,20.28 D1.1
  vias: v2(10.8,18.67) v2(10.8,17.65) v2(10.8,16.64) v2(10.8,15.62) v2(11.61,18.67) v2(11.61,17.65) v2(11.61,16.64) v2(11.61,15.62) v2(12.43,18.67) v2(12.43,17.65) v2(12.43,16.64) v2(12.43,15.62) v2(13.25,18.67) v2(13.25,17.65) v2(13.25,16.64) v2(13.25,15.62) v2(14.07,18.67) v2(14.07,17.65) v2(14.07,16.64) v2(14.07,15.62) v2(14.88,18.67) v2(14.88,17.65) v2(14.88,16.64) v2(14.88,15.62) v2(15.7,18.67) v2(15.7,17.65) v2(15.7,16.64) v2(15.7,15.62) v2(16.52,18.67) v2(16.52,17.65) v2(16.52,16.64) v2(16.52,15.62) v2(17.34,18.67) v2(17.34,17.65) v2(17.34,16.64) v2(17.34,15.62) v2(18.16,18.67) v2(18.16,17.65) v2(18.16,16.64) v2(18.16,15.62) v2(18.97,18.67) v2(18.97,17.65) v2(18.97,16.64) v2(18.97,15.62) v2(19.79,18.67) v2(19.79,17.65) v2(19.79,16.64) v2(19.79,15.62)
$1N3275: length 3.2
  Top Layer w0.152: U3.5 9.1,45.17 9.27,45.34 9.91,45.34 10.1,45.14 U3.4
$1N4044: length 2.6
  Top Layer w0.152: U3.8 R3.2
$1N4168: length 8.7
  Top Layer w0.152: 15.11,41.88 14.12,41.88 13.08,42.93 13.08,44.11 U3.1 13.1,45.19 12.95,45.34 12.32,45.34 12.26,45.28 ; U3.2 12.1,45.12 12.26,45.28 ; 12.26,45.28 R4.1
